# EAGLE schematic TSL238T-breakout (EAGLE 9.2.0)
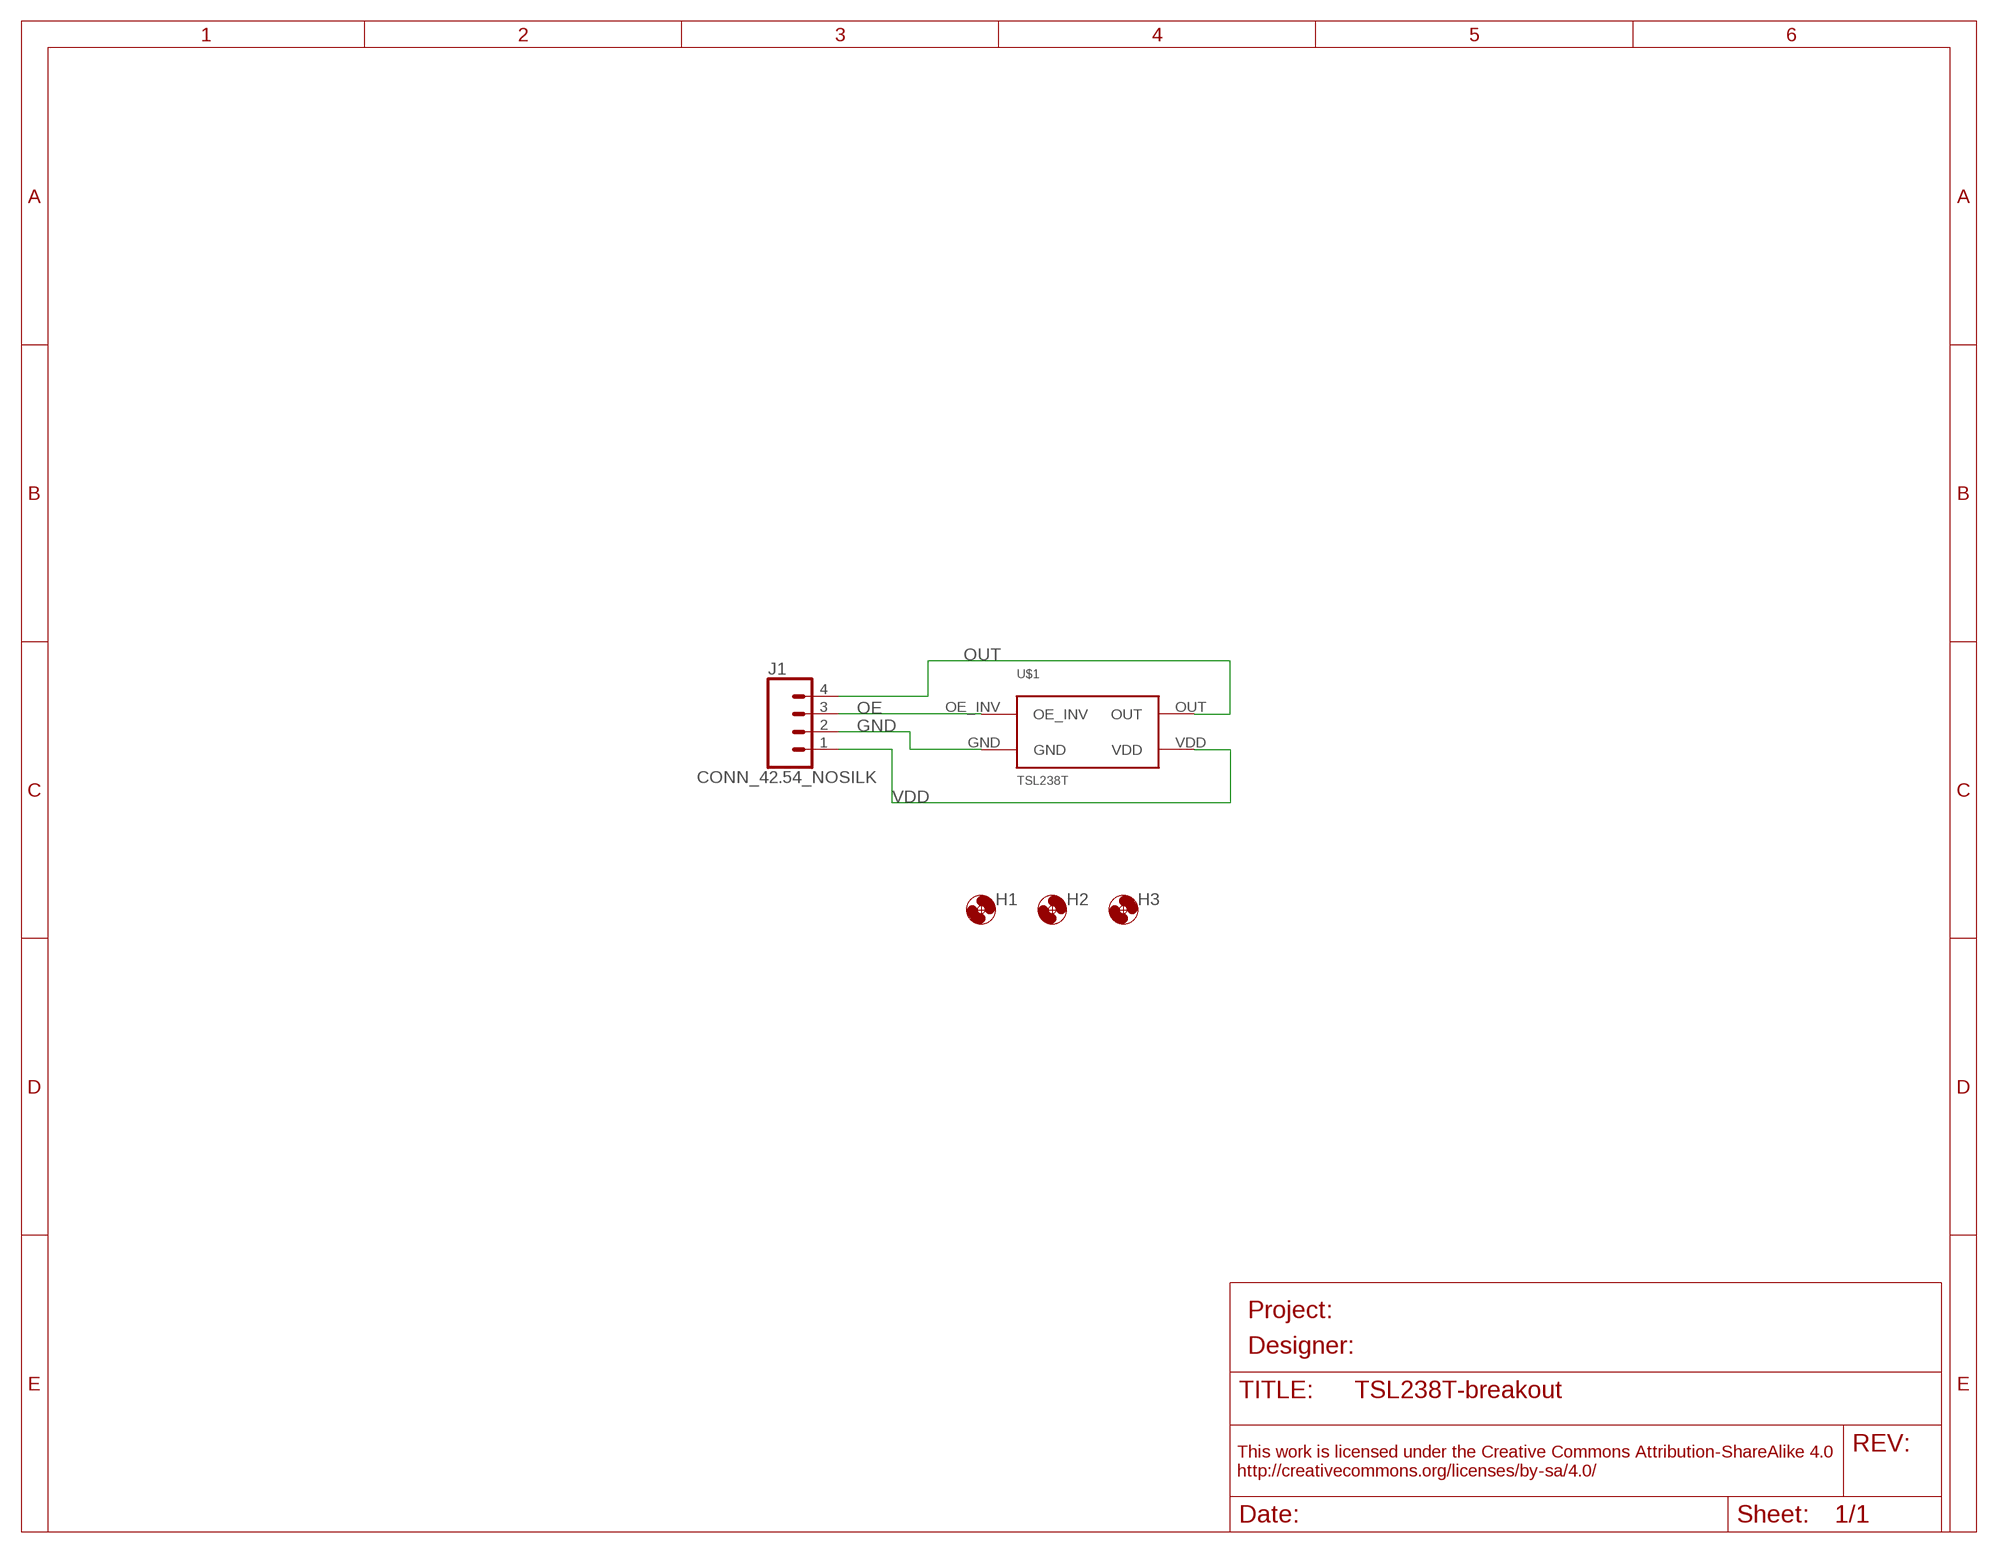
[diagram p0: schematic, sheet 1]

## Parts
H1  MOUNTING_HOLE2_NP  [2_56]
H2  MOUNTING_HOLE2_NP  [2_56]
H3  MOUNTING_HOLE2_NP  [2_56]
J1  CONN_42.54_NOSILK  [1X04_NOSILK]
U$1  TSL238T  [TSL238T]

## Nets
GND: J1.2 U$1.GND
OE: J1.3 U$1.OE_INV
OUT: J1.4 U$1.OUT
VDD: J1.1 U$1.VDD

## Library data of the parts
H1-H3 = bschulz:MOUNTING_HOLE: Genaric Mechanical Mounting Hole Hole diameter based on max body diameter + 15% Keepout ring is for diameter of socket cap screw (minimum required clearance) TPlace ring is for diameter of pan head screw (recomended clearance) Specifications: Socket Cap <http://fastener-express.com/fastener-technical/SocketscapSS-Alloy.pdf> Button Head Socket Cap <http://fastener-express.com/fastener-technical/Button-Socket-alloy.pdf> Pan Head <http://fastener-express.com/fastener-technical/pan-machine-Screws.pdf>
J1 = bschulz:CONN_4: Genaric 4 pin connector
U$1 = bschulz:TSL238T: High-Sensitivity Light-to-Frequency Converter